# EAGLE design Ace81 build04 (EAGLE 9.6.2)
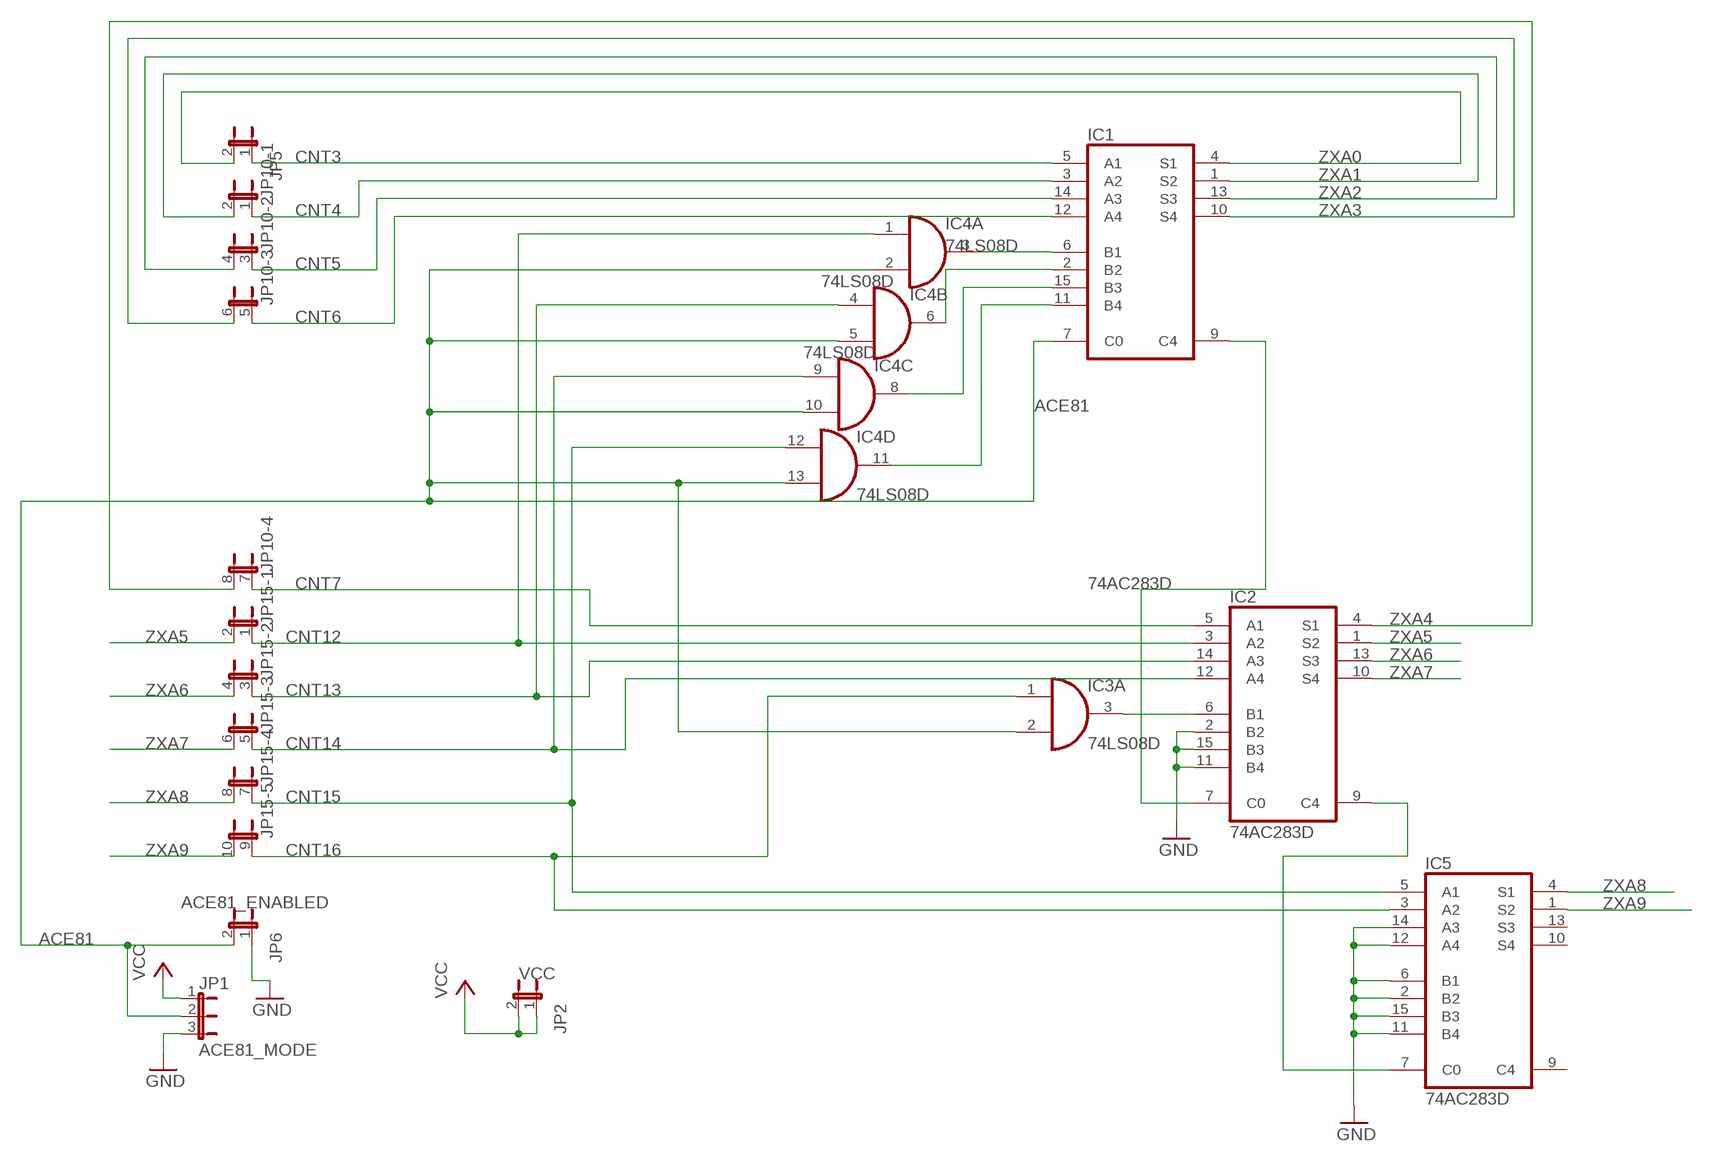
[diagram p0: schematic, sheet 1]

## Parts
IC1  74AC283D  [SO16]
IC2  74AC283D  [SO16]
IC3  74LS08D  [SO14]
IC4  74LS08D  [SO14]
IC5  74AC283D  [SO16]
JP1  ACE81_MODE  JP2E  [JP2]
JP2  VCC  JP1E1Q  [JP1Q]
JP5  JP1E1Q  [JP1Q]
JP6  ACE81_ENABLED  JP1E1Q  [JP1Q]
JP10  JP4QE  [JP4Q]
JP15  JP5QE  [JP5Q]

## Nets
ACE81: IC1.7(C0) IC3.2(A:I1) IC4.2(A:I1) IC4.5(B:I1) IC4.10(C:I1) IC4.13(D:I1) JP1.2 JP6.2
CNT3: IC1.5(A1) JP5.1
CNT4: IC1.3(A2) JP10.1
CNT5: IC1.14(A3) JP10.3
CNT6: IC1.12(A4) JP10.5
CNT7: IC2.5(A1) JP10.7
CNT12: IC2.3(A2) IC4.1(A:I0) JP15.1
CNT13: IC2.14(A3) IC4.4(B:I0) JP15.3
CNT14: IC2.12(A4) IC4.9(C:I0) JP15.5
CNT15: IC4.12(D:I0) IC5.5(A1) JP15.7
CNT16: IC3.1(A:I0) IC5.3(A2) JP15.9
GND: IC2.2(B2) IC2.11(B4) IC2.15(B3) IC5.2(B2) IC5.6(B1) IC5.11(B4) IC5.12(A4) IC5.14(A3) IC5.15(B3) JP1.3 JP6.1
N$1: IC1.9(C4) IC2.7(C0)
N$2: IC2.9(C4) IC5.7(C0)
N$3: IC1.6(B1) IC4.3(A:O)
N$4: IC1.2(B2) IC4.6(B:O)
N$5: IC1.15(B3) IC4.8(C:O)
N$6: IC1.11(B4) IC4.11(D:O)
N$7: IC2.6(B1) IC3.3(A:O)
VCC: JP1.1 JP2.1 JP2.2
ZXA0: IC1.4(S1) JP5.2
ZXA1: IC1.1(S2) JP10.2
ZXA2: IC1.13(S3) JP10.4
ZXA3: IC1.10(S4) JP10.6
ZXA4: IC2.4(S1) JP10.8
ZXA5: IC2.1(S2) JP15.2
ZXA6: IC2.13(S3) JP15.4
ZXA7: IC2.10(S4) JP15.6
ZXA8: IC5.4(S1) JP15.8
ZXA9: IC5.1(S2) JP15.10
Unconnected: IC3.4(B:I0) IC3.5(B:I1) IC3.6(B:O) IC3.8(C:O) IC3.9(C:I0) IC3.10(C:I1) IC3.11(D:O) IC3.12(D:I0) IC3.13(D:I1) IC5.9(C4) IC5.10(S4) IC5.13(S3)

## Power pins joined to a net without a drawn wire
GND: IC1.8(GND) IC2.8(GND) IC3.7(P:GND) IC4.7(P:GND) IC5.8(GND)
VCC: IC1.16(VCC) IC2.16(VCC) IC3.14(P:VCC) IC4.14(P:VCC) IC5.16(VCC)

## Library data of the parts
IC1 IC2 IC5 = 74xx-eu:74*283: 4-bit binary FULL ADDER, fast carry
IC3 IC4 = 74xx-eu:74*08: Quad 2-input AND gate
JP1 = jumper:JP2E: JUMPER
JP2 JP5 JP6 = jumper:JP1E: JUMPER
JP10 = jumper:JP4QE: JUMPER
JP15 = jumper:JP5QE: JUMPER

## Net classes
0 default: width 0.2 mm
1 power: width 0.4 mm

## Board
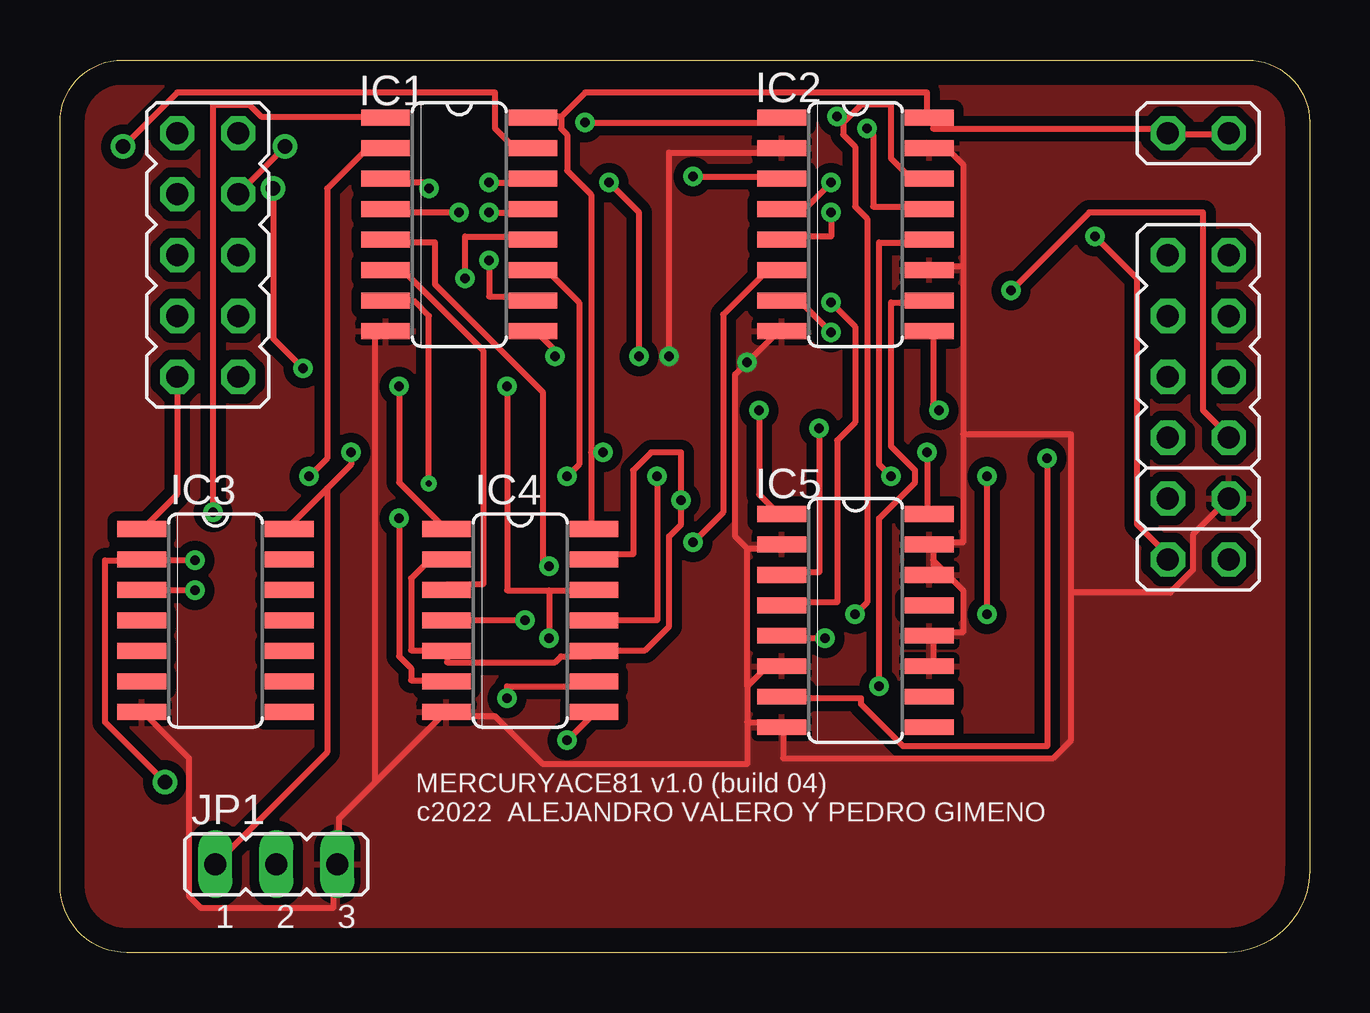
[diagram p1: board, top side]
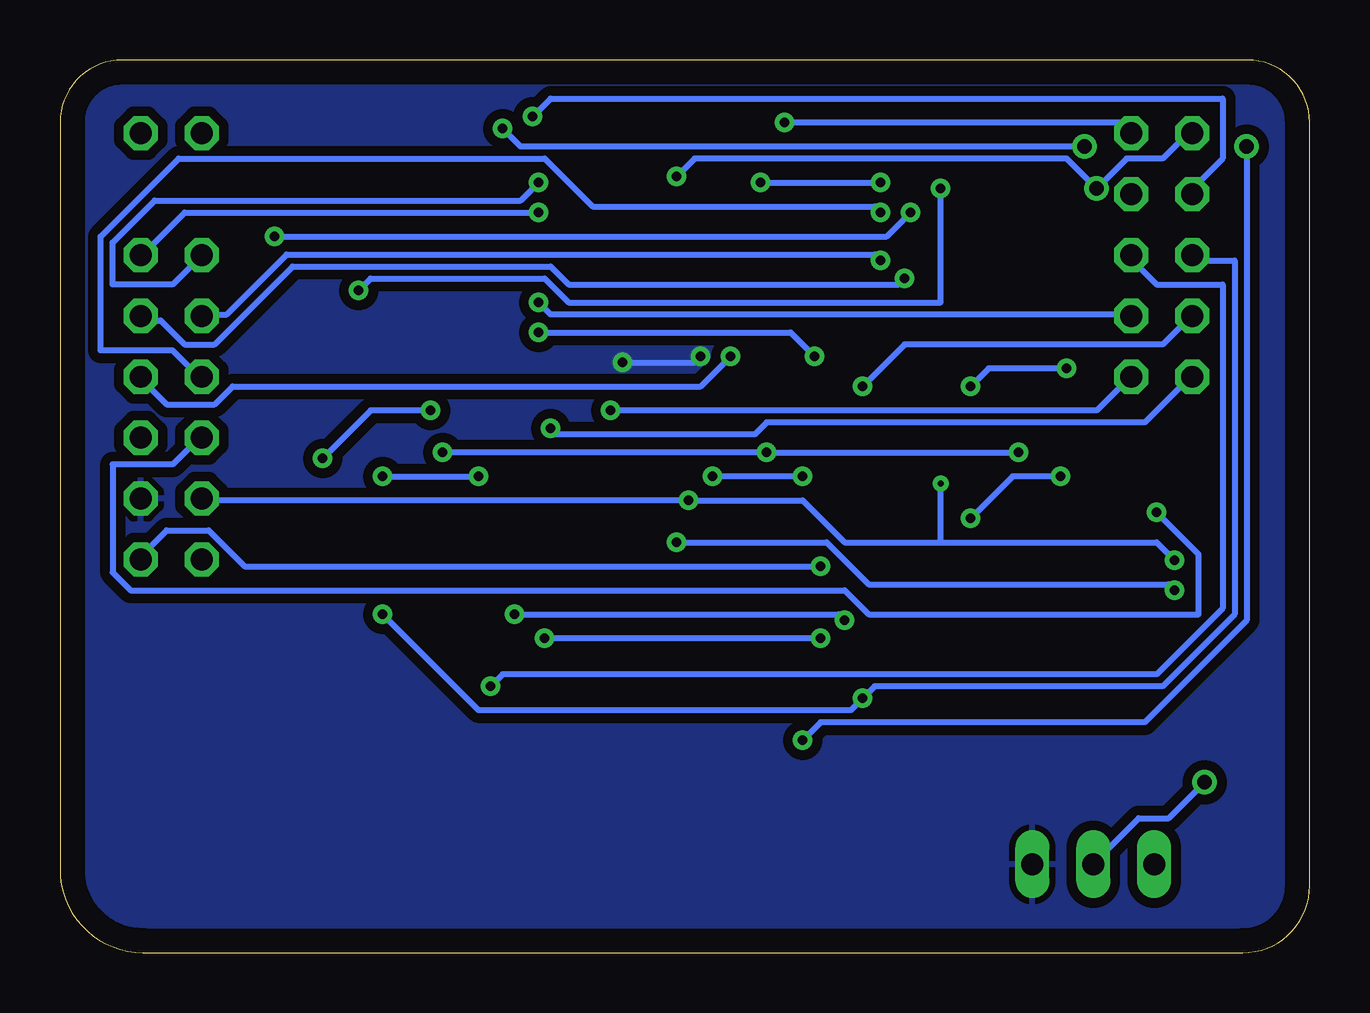
[diagram p2: board, bottom side, seen from below]

Size 52.07 x 37.21 mm. Coordinates in mm from the lower left corner, seen from the top.
Outline: 2.6,37.21 49.47,37.21 arc-90 52.07,34.61 52.07,3.46 arc-90 48.61,0 2.79,0 arc-90 0,2.79 0,34.61 arc-90 2.6,37.21
Copper layers (1*16): Top 0.035mm / dielectric 1.5mm / Bottom 0.035mm
Design rules "default *": minimum track width 10mil, minimum drill 10mil, track to track 8mil, track to pad 8mil, pad to pad 8mil, via to via 8mil, smd to smd 8mil, copper to edge 40mil, drill to drill 8mil, minimum pad ring 10mil, minimum via ring 8mil, stop-mask expansion 4mil, vias tented up to drill 0mil, thermal gap 10mil

### Footprints (pad centres in the part's own frame; a part is rotated, then mirrored left to right if it is on the bottom)
SO16 = smd 0.66 x 2.032: 1 -4.445,-3.073; 2 -3.175,-3.073; 3 -1.905,-3.073; 4 -0.635,-3.073; 5 0.635,-3.073; 6 1.905,-3.073; 7 3.175,-3.073; 8 4.445,-3.073; 9 4.445,3.073; 10 3.175,3.073; 11 1.905,3.073; 12 0.635,3.073; 13 -0.635,3.073; 14 -1.905,3.073; 15 -3.175,3.073; 16 -4.445,3.073
SO14 = smd 0.66 x 2.032: 1 -3.81,-3.073; 2 -2.54,-3.073; 3 -1.27,-3.073; 4 0,-3.073; 5 1.27,-3.073; 6 2.54,-3.073; 7 3.81,-3.073; 8 3.81,3.073; 9 2.54,3.073; 10 1.27,3.073; 11 0,3.073; 12 -1.27,3.073; 13 -2.54,3.073; 14 -3.81,3.073
JP2 = drill 0.914 long: 1 -2.54,0; 2 0,0; 3 2.54,0
JP1Q = drill 0.914 octagon: 1 -1.27,-1.27; 2 -1.27,1.27
JP4Q = drill 0.914 octagon: 1 -3.81,-1.27; 2 -3.81,1.27; 3 -1.27,-1.27; 4 -1.27,1.27; 5 1.27,-1.27; 6 1.27,1.27; 7 3.81,-1.27; 8 3.81,1.27
JP5Q = drill 0.914 octagon: 1 -5.08,-1.27; 2 -5.08,1.27; 3 -2.54,-1.27; 4 -2.54,1.27; 5 0,-1.27; 6 0,1.27; 7 2.54,-1.27; 8 2.54,1.27; 9 5.08,-1.27; 10 5.08,1.27

### Placement (x,y rotation side)
IC1  16.64,30.35 270 top
IC2  33.15,30.35 270 top
IC3  6.48,13.84 270 top
IC4  19.18,13.84 270 top
IC5  33.15,13.84 270 top
JP1  9.02,3.68 0 top
JP2  47.43,35.43 90 top
JP5  47.43,17.65 90 top
JP6  47.43,20.19 90 top
JP10  47.43,25.27 90 top
JP15  6.16,29.08 270 top

### Tracks (layer width: path | path; a pad name or v marks a point on that pad's centre or on a via)
ACE81  (via drill 0.25, 0.4, 0.4 pad 0.38, 0.61)
  Top 0.254: v4.38,7.1 1.88,9.6 1.88,16.35 3.38,16.35 IC3.2 3.63,16.35 v5.63,16.35 | IC4.2 15.88,16.35 15.38,16.35 14.63,15.6 14.63,12.6 15.88,12.6 IC4.5 16.13,12.35 16.13,12.1 20.63,12.1 20.88,12.35 22.13,12.35 IC4.10 22.38,12.6 24.38,12.6 25.38,13.6 25.38,17.35 25.88,17.85 v25.88,18.85 25.88,20.85 24.63,20.85 23.88,20.1 23.88,16.6 22.38,16.6 IC4.13 | IC1.7 14.73,27.18 15.37,26.54 v15.37,19.56
  Bottom 0.254: v4.38,7.1 5.88,5.6 7.13,5.6 8.88,3.85 JP1.2 | JP6.2 46.13,18.85 v25.88,18.85 21.13,18.85 19.38,17.1 15.37,17.1 | v5.63,16.35 6.38,17.1 15.37,17.1 | 15.37,17.1 v15.37,19.56
CNT3  (via drill 0.4)
  Top 0.254: v20.38,16.1 20.13,16.35 20.13,23.35 15.63,27.85 15.63,29.6 13.63,29.6 IC1.5
  Bottom 0.254: v20.38,16.1 44.38,16.1 45.88,17.6 47.63,17.6 48.63,16.6 JP5.1
CNT4  (via drill 0.4)
  Top 0.254: v15.38,31.85 15.38,32.1 13.63,32.1 IC1.3 | v39.63,27.6 42.88,30.85 47.63,30.85 47.63,22.6 48.63,21.6 JP10.1
  Bottom 0.254: v15.38,31.85 15.38,27.1 30.88,27.1 31.88,28.1 39.13,28.1 v39.63,27.6
CNT5  (via drill 0.4)
  Top 0.254: v17.88,32.1 19.63,32.1 IC1.14 | v22.88,32.1 24.13,30.85 v24.13,24.85
  Bottom 0.254: v22.88,32.1 v17.88,32.1 | v24.13,24.85 25.38,23.6 44.88,23.6 45.63,22.85 47.63,22.85 48.63,23.85 JP10.3
CNT6  (via drill 0.4)
  Top 0.254: v16.88,28.1 16.88,29.85 19.63,29.85 IC1.12
  Bottom 0.254: v16.88,28.1 17.13,27.85 30.88,27.85 31.63,28.6 42.38,28.6 45.63,25.35 46.88,25.35 47.88,26.35 48.63,26.35 JP10.5
CNT7  (via drill 0.4)
  Top 0.254: v32.13,30.85 32.13,29.85 30.13,29.85 IC2.5
  Bottom 0.254: v32.13,30.85 46.88,30.85 48.63,29.1 JP10.7
CNT12  (via drill 0.4, 0.61)
  Top 0.254: v14.13,23.6 14.13,19.6 15.88,17.85 IC4.1 | v10.13,24.35 8.88,25.6 v8.88,31.85 | v26.38,32.35 29.88,32.35 IC2.3
  Bottom 0.254: v14.13,23.6 13.38,24.35 v10.13,24.35 | JP15.1 5.13,34.1 6.13,33.1 7.63,33.1 v8.88,31.85 10.13,33.1 25.63,33.1 v26.38,32.35
CNT13  (via drill 0.4)
  Top 0.254: v19.38,13.85 16.13,13.85 IC4.4 | v33.13,14.1 33.63,14.6 33.63,30.6 33.13,31.1 33.13,33.6 32.63,34.1 32.63,34.6 | 32.63,34.6 33.38,35.35 34.63,35.35 34.63,33.1 35.38,32.35 36.13,32.35 IC2.14 | 32.63,34.6 v32.38,34.85
  Bottom 0.254: v19.38,13.85 19.63,14.1 v33.13,14.1 | v32.38,34.85 31.63,35.6 3.63,35.6 3.63,33.1 4.88,31.85 JP15.3
CNT14  (via drill 0.4)
  Top 0.254: v18.63,10.6 18.63,11.1 22.13,11.1 IC4.9 | v34.63,19.85 34.13,20.35 34.13,29.6 36.13,29.6 IC2.12 | v38.63,14.1 v38.63,19.85
  Bottom 0.254: JP15.5 4.88,28.85 3.13,28.85 3.13,14.1 6.13,11.1 18.13,11.1 v18.63,10.6 19.13,10.1 34.63,10.1 v38.63,14.1 | v38.63,19.85 v34.63,19.85
CNT15  (via drill 0.4)
  Top 0.254: 20.38,15.1 18.63,15.1 v18.63,23.6 | 20.38,15.1 22.13,15.1 IC4.12 | v31.88,13.1 30.13,13.1 IC5.5 | 20.38,15.1 v20.38,13.1
  Bottom 0.254: v18.63,23.6 16.88,25.35 6.13,25.35 5.13,26.35 JP15.7 | v20.38,13.1 v31.88,13.1
CNT16  (via drill 0.4)
  Top 0.254: IC3.1 3.63,17.85 4.88,19.1 4.88,23.85 JP15.9 | v31.63,21.85 31.63,15.85 30.13,15.85 IC5.3
  Bottom 0.254: v31.63,21.85 31.38,21.6 23.13,21.6 22.63,22.1 6.88,22.1 5.13,23.85 JP15.9
GND  (via drill 0.4)
  Top 0.254: IC3.7 3.63,9.85 5.38,8.1 5.38,2.35 5.88,1.85 11.38,1.85 11.38,3.6 JP1.3 11.63,3.85 11.63,5.6 13.13,7.1 | 13.13,7.1 15.88,9.85 IC4.7 16.13,9.85 18.13,9.85 20.13,7.85 28.63,7.85 28.63,9.6 | 13.13,7.1 13.13,25.6 13.38,25.85 IC1.8 | IC5.11 36.38,12.1 36.38,13.1 IC5.12 36.38,13.35 37.63,13.35 37.63,15.1 36.38,16.35 | 36.38,16.35 36.38,16.85 IC5.15 36.38,17.1 37.63,17.1 37.63,21.6 | 36.38,16.35 36.38,15.85 IC5.14 | 37.63,28.6 36.38,28.6 IC2.11 | 37.63,28.6 37.63,32.85 37.13,33.35 36.38,33.35 IC2.15 | 37.63,28.6 37.63,21.6 | 28.63,9.6 29.88,9.6 IC5.8 30.13,9.35 30.13,8.1 41.38,8.1 42.13,8.85 42.13,15.01 | 28.63,11.1 28.63,9.6 | 28.63,11.1 29.38,11.85 29.88,11.85 IC5.6 | 28.63,16.85 29.88,16.85 IC5.2 | 28.63,11.1 28.63,16.85 | 28.63,16.85 28.13,17.35 28.13,24.1 v28.63,24.6 29.88,25.85 IC2.8 | v25.38,24.85 25.38,33.35 29.88,33.35 IC2.2 | 37.63,21.6 42.13,21.6 42.13,15.01 | JP6.1 47.21,17.42 47.21,15.95 46.27,15.01 42.13,15.01
  Bottom 0.254: v25.38,24.85 25.63,24.6 v28.63,24.6
  pour Top (isolate 0.406): 0.13,-0.13 52.2,-0.13 52.2,37.97 0.13,37.97
  pour Bottom (isolate 0.406): 0.13,37.97 0.13,-0.13 52.2,-0.13 52.2,37.97
N$1  (via drill 0.4)
  Top 0.254: v20.63,24.85 20.63,25.1 19.88,25.85 IC1.9 | v32.13,25.85 30.88,27.1 30.13,27.1 IC2.7
  Bottom 0.254: v20.63,24.85 21.63,25.85 v32.13,25.85
N$2  (via drill 0.4)
  Top 0.254: v41.13,20.6 41.13,8.6 35.13,8.6 33.38,10.35 33.38,10.6 30.13,10.6 IC5.7 | v36.63,22.6 36.38,22.85 36.38,25.85 IC2.9
  Bottom 0.254: v41.13,20.6 39.13,22.6 v36.63,22.6
N$3
  Top 0.254: IC4.3 16.13,15.35 17.63,15.35 17.63,25.1 14.38,28.35 13.63,28.35 IC1.6
N$4  (via drill 0.4)
  Top 0.254: v14.13,18.1 14.13,12.35 14.63,11.85 14.63,11.35 15.88,11.35 IC4.6 | v10.38,19.85 11.13,20.6 11.13,31.85 12.63,33.35 13.38,33.35 IC1.2
  Bottom 0.254: v14.13,18.1 12.38,19.85 v10.38,19.85
N$5  (via drill 0.4, 0.61)
  Top 0.254: v21.13,8.85 22.13,9.85 IC4.8 | v2.63,33.6 4.88,35.85 18.13,35.85 18.13,34.35 18.88,33.6 19.63,33.6 IC1.15
  Bottom 0.254: v21.13,8.85 20.38,9.6 6.88,9.6 2.63,13.85 v2.63,33.6
N$6  (via drill 0.4)
  Top 0.254: v24.88,19.85 24.88,13.85 22.38,13.85 IC4.11 | v21.13,19.85 21.63,20.35 21.63,27.1 20.38,28.35 19.88,28.35 IC1.11
  Bottom 0.254: v21.13,19.85 v24.88,19.85
N$7  (via drill 0.4)
  Top 0.254: v5.63,15.1 3.63,15.1 IC3.3 | v26.38,17.1 27.63,18.35 27.63,26.6 29.38,28.35 29.88,28.35 IC2.6
  Bottom 0.254: v5.63,15.1 5.88,15.35 18.38,15.35 20.13,17.1 v26.38,17.1
VCC  (via drill 0.4)
  Top 0.254: 11.13,19.35 12.13,20.35 v12.13,20.85 | 11.13,19.35 9.63,17.85 IC3.14 | 11.13,19.35 11.13,8.35 6.63,3.85 JP1.1 | JP2.1 48.63,34.1 46.38,34.1 JP2.2 46.13,34.35 36.38,34.35 36.38,34.6 IC2.16 36.13,34.85 36.13,35.85 21.88,35.85 20.88,34.85 | 20.88,34.85 19.88,34.85 IC1.16 | 22.13,20.85 22.13,31.6 21.13,32.6 21.13,34.1 20.88,34.35 20.88,34.85 | 22.13,20.85 22.13,17.85 IC4.14 | v36.13,20.85 36.13,18.35 IC5.16 | 22.13,20.85 v22.63,20.85
  Bottom 0.254: v36.13,20.85 v22.63,20.85 v12.13,20.85
ZXA0  (via drill 0.4)
  Top 0.254: v16.63,30.85 13.63,30.85 IC1.4 | v43.13,29.85 44.88,28.1 44.88,17.85 46.13,16.6 JP5.2
  Bottom 0.254: v16.63,30.85 17.63,29.85 v43.13,29.85
ZXA1  (via drill 0.4)
  Top 0.254: v6.38,18.35 6.38,35.35 7.88,35.35 8.38,34.85 13.38,34.85 IC1.1
  Bottom 0.254: v6.38,18.35 4.63,16.6 4.63,14.1 18.38,14.1 19.38,15.1 49.13,15.1 49.88,15.85 49.88,20.35 47.38,20.35 46.38,21.35 JP10.2
ZXA2  (via drill 0.4)
  Top 0.254: v17.88,30.85 19.63,30.85 IC1.13
  Bottom 0.254: v17.88,30.85 18.13,31.1 29.88,31.1 31.88,33.1 47.13,33.1 50.38,29.85 50.38,25.1 47.38,25.1 46.38,24.1 JP10.4
ZXA3  (via drill 0.4)
  Top 0.254: v17.88,28.85 17.88,27.35 19.63,27.35 IC1.10
  Bottom 0.254: v17.88,28.85 18.13,29.1 42.63,29.1 45.13,26.6 46.13,26.6 JP10.6
ZXA4  (via drill 0.4)
  Top 0.254: v32.13,32.1 31.13,31.1 30.13,31.1 IC2.4
  Bottom 0.254: v32.13,32.1 32.88,31.35 48.13,31.35 49.88,29.6 49.88,27.85 47.38,27.85 46.38,28.85 JP10.8
ZXA5  (via drill 0.4)
  Top 0.254: v21.88,34.6 29.88,34.6 IC2.1
  Bottom 0.254: v21.88,34.6 7.88,34.6 7.63,34.35 JP15.2
ZXA6  (via drill 0.4, 0.61)
  Top 0.254: v33.63,34.35 33.88,34.1 33.88,31.1 36.13,31.1 IC2.13 | v9.38,33.6 7.63,31.85 JP15.4
  Bottom 0.254: v33.63,34.35 32.88,33.6 v9.38,33.6
ZXA7  (via drill 0.4)
  Top 0.254: v34.13,11.1 34.13,18.1 35.63,19.6 35.63,20.1 34.63,21.1 34.63,27.1 36.13,27.1 IC2.10
  Bottom 0.254: v34.13,11.1 33.63,11.6 6.38,11.6 3.63,14.35 3.63,27.85 6.38,27.85 7.38,28.85 JP15.6
ZXA8  (via drill 0.4)
  Top 0.254: v32.13,27.1 33.13,26.1 33.13,22.1 32.38,21.35 32.38,14.6 30.13,14.6 IC5.4
  Bottom 0.254: v32.13,27.1 31.63,26.6 7.63,26.6 JP15.8
ZXA9  (via drill 0.4)
  Top 0.254: v29.13,22.6 29.13,19.1 29.88,18.35 IC5.1
  Bottom 0.254: v29.13,22.6 8.88,22.6 7.63,23.85 JP15.10

### Text on the board
tNames: MERCURYACE81 v1.0 (build 04) / 2022 ALEJANDRO VALERO Y PEDRO GIMENO | c
tValues: ZX81 | ACE